# EAGLE design JL_2019_V1.0 (EAGLE 9.3.2)
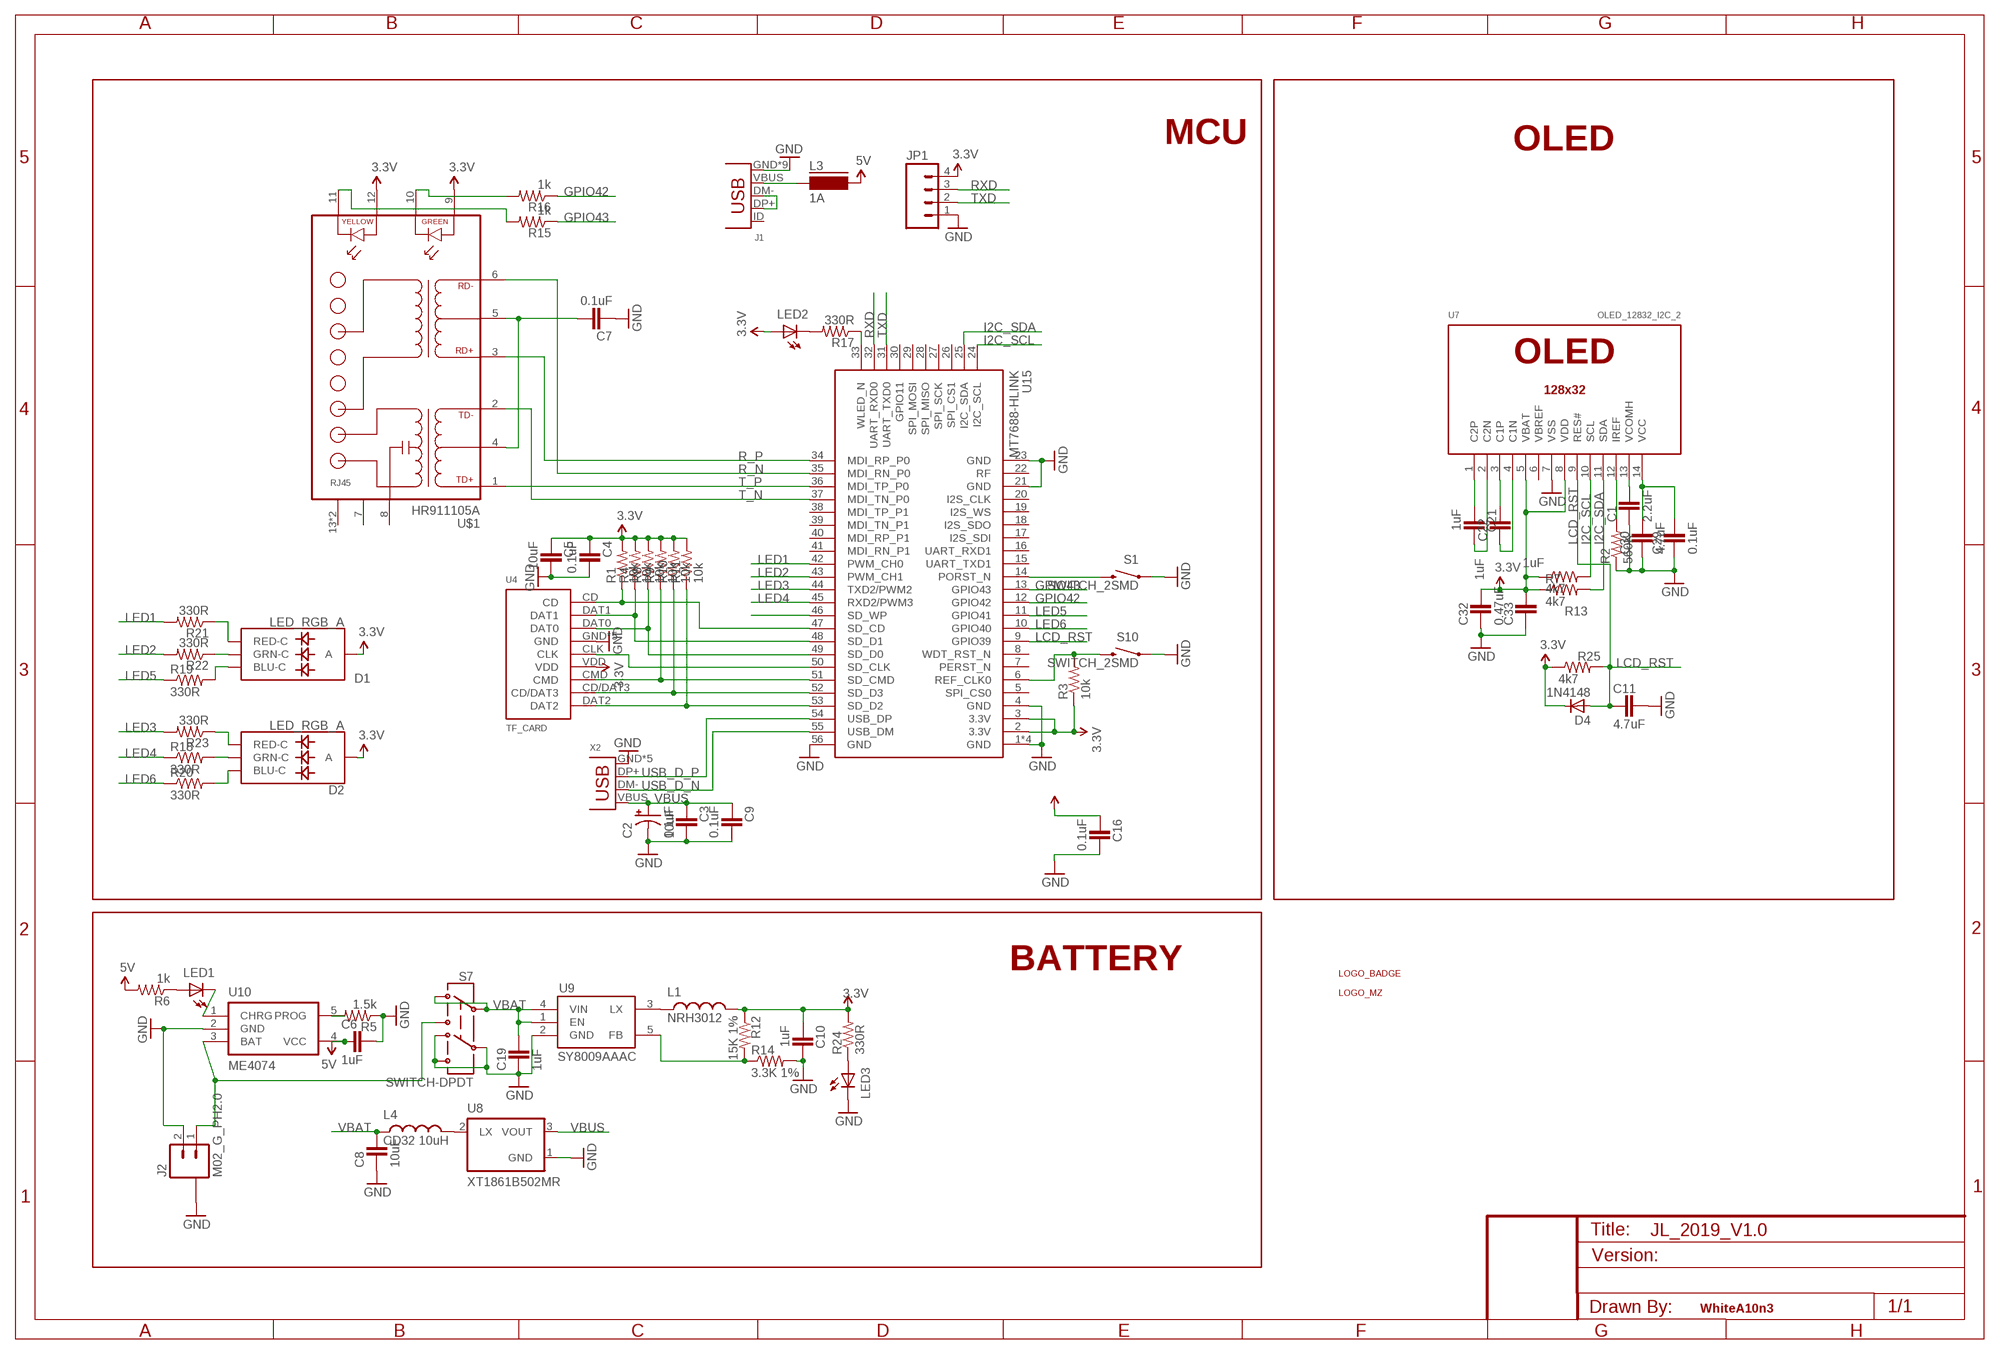
[diagram p0: schematic, sheet 1]

## Parts
C1  2.2uF  CAP0603  [0603-CAP]
C2  10uF  CAP_POL1206  [EIA3216]
C3  0.1uF  CAP0603  [0603-CAP]
C4  0.1uF  CAP0603  [0603-CAP]
C5  10uF  CAP0603  [0603-CAP]
C6  1uF  CAP0603  [0603-CAP]
C7  0.1uF  CAP0603  [0603-CAP]
C8  10uF  CAP0603  [0603-CAP]
C9  0.1uF  CAP0603  [0603-CAP]
C10  1uF  CAP0603  [0603-CAP]
C11  4.7uF  CAP0603  [0603-CAP]
C16  0.1uF  CAP0603  [0603-CAP]
C19  1uF  CAP0603  [0603-CAP]
C21  1uF  CAP0603  [0603-CAP]
C22  1uF  CAP0603  [0603-CAP]
C29  0.1uF  CAP0603  [0603-CAP]
C30  4.7uF  CAP0603  [0603-CAP]
C32  0.47uF  CAP0603  [0603-CAP]
C33  1uF  CAP0603  [0603-CAP]
D1  LED_RGB_A  [RGB-1615-A]
D2  LED_RGB_A  [RGB-1615-A]
D4  1N4148  DIODE_SOD-323F  [SOD-323F]
J1  USB_5_MICRO_4  [USB-MICRO-4]
J2  M02_G_PH2.0  [PH2.0_SMD_2]
JP1  M04PTH  [1X04]
L1  NRH3012  INDUCTOR1210  [1210]
L3  1A  FERRITE-0805  [FB805]
L4  CD32 10uH  INDUCTOR_CD32  [CD32]
LED1  LED0603  [LED-0603]
LED2  LED0603  [LED-0603]
LED3  LED0603  [LED-0603]
R1  10k  RESISTOR0603-RES  [0603-RES]
R2  560K  RESISTOR0603-RES  [0603-RES]
R3  10k  RESISTOR0603-RES  [0603-RES]
R4  10k  RESISTOR0603-RES  [0603-RES]
R5  1.5k  RESISTOR0603-RES  [0603-RES]
R6  1k  RESISTOR0603-RES  [0603-RES]
R7  4k7  RESISTOR0603-RES  [0603-RES]
R8  10k  RESISTOR0603-RES  [0603-RES]
R9  10k  RESISTOR0603-RES  [0603-RES]
R10  10k  RESISTOR0603-RES  [0603-RES]
R11  10k  RESISTOR0603-RES  [0603-RES]
R12  15K 1%  RESISTOR0603-RES  [0603-RES]
R13  4k7  RESISTOR0603-RES  [0603-RES]
R14  3.3K 1%  RESISTOR0603-RES  [0603-RES]
R15  1k  RESISTOR0603-RES  [0603-RES]
R16  1k  RESISTOR0603-RES  [0603-RES]
R17  330R  RESISTOR0603-RES  [0603-RES]
R18  330R  RESISTOR0603-RES  [0603-RES]
R19  330R  RESISTOR0603-RES  [0603-RES]
R20  330R  RESISTOR0603-RES  [0603-RES]
R21  330R  RESISTOR0603-RES  [0603-RES]
R22  330R  RESISTOR0603-RES  [0603-RES]
R23  330R  RESISTOR0603-RES  [0603-RES]
R24  330R  RESISTOR0603-RES  [0603-RES]
R25  4k7  RESISTOR0603-RES  [0603-RES]
S1  SWITCH_2SMD  [TACTILE_SWITCH_SMD]
S7  SWITCH-DPDT  [MSS22D18]
S10  SWITCH_2SMD  [TACTILE_SWITCH_SMD]
U4  TF_CARD  [MICRO-SD-TF]
U5  LOGO_BADGE_24.3_20_S  [LOGO_BADGE_24.3_20_S]
U6  LOGO_MZ_16_14_S  [LOGO_MZ_16_14_S]
U7  OLED_12832_I2C_2  [OLED_12832_0.91_2]
U8  XT1861B502MR  XT1861  [SOT23-3]
U9  SY8009AAAC  SY8009A  [SOT23-5]
U10  ME4074  [SOT23-5]
U15  MT7688-HLINK  [MT7688_HLINK]
U$1  HR911105A  [HR911105A]
X2  USB_4_4  [USB-A-4]

## Nets
3.3V: C4.2 C5.2 C10.2 C16.2 C32.1 C33.1 D1.A D2.A D4.C JP1.4 L1.2 LED2.A R1.2 R3.1 R4.2 R7.1 R8.2 R9.2 R10.2 R11.2 R12.1 R13.1 R24.2 R25.1 U4.VDD U7.5(VBAT) U7.8(VDD) U15.2(3.3V) U15.3(3.3V) U$1.9 U$1.12
5V: C6.2 L3.1 R6.2 U10.4(VCC)
GND: C1.2 C2.C(-) C3.1 C4.1 C5.1 C6.1 C7.2 C8.2 C9.1 C10.1 C11.1 C16.1 C19.2 C29.2 C30.2 C32.2 C33.2 J1.GND J1.MT1(GND) J1.MT2(GND) J1.MT5(GND) J1.MT6(GND) J1.MT7(GND) J1.MT8(GND) J1.MT9(GND) J1.MT10(GND) J2.2 J2.G1(G) J2.G2(G) JP1.1 LED3.C R2.1 R5.1 R14.2 S1.1 S7.4 S7.5 S7.6 S10.1 U4.GND U4.GND1(GND) U4.GND2(GND) U4.GND3(GND) U4.GND4(GND) U7.7(VSS) U8.1(GND) U9.2(GND) U10.2(GND) U15.1(GND) U15.4(GND) U15.21(GND) U15.23(GND) U15.56(GND) U15.PAD1(GND) U15.PAD2(GND) U15.PAD(GND) X2.GND X2.P$5(GND) X2.P$6(GND) X2.P$7(GND) X2.P$8(GND)
GPIO42: R16.1 U15.12(GPIO42)
GPIO43: R15.1 U15.13(GPIO43)
I2C_SCL: R13.2 U7.10(SCL) U15.24(I2C_SCL)
I2C_SDA: R7.2 U7.11(SDA) U15.25(I2C_SDA)
LCD_RST: C11.2 D4.A R25.2 U7.9(RES#) U15.9(GPIO39)
LED1: R21.2 U15.42(PWM_CH0)
LED2: R22.2 U15.43(PWM_CH1)
LED3: R23.2 U15.44(TXD2/PWM2)
LED4: R18.1 U15.45(RXD2/PWM3)
LED5: R19.1 U15.11(GPIO41)
LED6: R20.1 U15.10(GPIO40)
N$1: L4.P$2 U8.2(LX)
N$2: LED3.A R24.1
N$3: J2.1 S7.3 U10.3(BAT)
N$4: C1.1 U7.13(VCOMH)
N$5: D1.R(RED-C) R21.1
N$6: D1.G(GRN-C) R22.1
N$7: R5.2 U10.5(PROG)
N$8: R11.1 U4.DAT2 U15.53(SD_D2)
N$9: R10.1 U4.CD/DAT3 U15.52(SD_D3)
N$10: LED1.A R6.1
N$11: LED1.C U10.1(CHRG)
N$12: J1.VBUS L3.2
N$13: R9.1 U4.CMD U15.51(SD_CMD)
N$14: U4.CLK U15.50(SD_CLK)
N$15: R1.1 U4.CD U15.47(SD_CD)
N$16: C21.2 U7.1(C2P)
N$17: C21.1 U7.2(C2N)
N$18: C22.1 U7.3(C1P)
N$19: C22.2 U7.4(C1N)
N$20: R8.1 U4.DAT0 U15.49(SD_D0)
N$21: C29.1 C30.1 U7.14(VCC)
N$22: R2.2 U7.12(IREF)
N$23: R4.1 U4.DAT1 U15.48(SD_D1)
N$24: L1.1 U9.3(LX)
N$25: R12.2 R14.1 U9.5(FB)
N$26: D1.B(BLU-C) R19.2
N$27: D2.R(RED-C) R23.1
N$28: D2.G(GRN-C) R18.2
N$30: C7.1 U$1.4 U$1.5
N$31: R15.2 U$1.11
N$32: R16.2 U$1.10
N$33: LED2.C R17.2
N$35: R17.1 U15.33(WLED_N)
N$37: U15.46(SD_WP)
N$39: D2.B(BLU-C) R20.2
N$44: J1.DM-(D-) J1.DP+(D+)
R_N: U15.35(MDI_RN_P0) U$1.6
R_P: U15.34(MDI_RP_P0) U$1.3
RST: S1.3 U15.14(PORST_N)
RST2: R3.2 S10.3 U15.6(REF_CLK0)
RXD: JP1.3 U15.32(UART_RXD0)
T_N: U15.37(MDI_TN_P0) U$1.2
T_P: U15.36(MDI_TP_P0) U$1.1
TXD: JP1.2 U15.31(UART_TXD0)
USB_D_N: U15.55(USB_DM) X2.DM-
USB_D_P: U15.54(USB_DP) X2.DP+
VBAT: C8.1 C19.1 L4.P$1 S7.1 S7.2 U9.1(EN) U9.4(VIN)
VBUS: C2.A(+) C3.2 C9.2 U8.3(VOUT) X2.VBUS
Unconnected: J1.ID(USBID) U7.6(VBREF) U15.5(SPI_CS0) U15.7(PERST_N) U15.8(WDT_RST_N) U15.15(UART_TXD1) U15.16(UART_RXD1) U15.17(I2S_SDI) U15.18(I2S_SDO) U15.19(I2S_WS) U15.20(I2S_CLK) U15.22(RF) U15.26(SPI_CS1) U15.27(SPI_SCK) U15.28(SPI_MISO) U15.29(SPI_MOSI) U15.30(GPIO11) U15.38(MDI_TP_P1) U15.39(MDI_TN_P1) U15.40(MDI_RP_P1) U15.41(MDI_RN_P1) U$1.7 U$1.8 U$1.13(G) U$1.14(G)

## Notes on the sheet
- MCU | OLED
- BATTERY
- WhiteA10n3

## Library data of the parts
C1 C3-C11 C16 C19 C21 C22 C29 C30 C32 C33 = 2SparkFun:CAP: Capacitor Standard 0603 ceramic capacitor, and 0.1" leaded capacitor.
C2 = 2SparkFun:CAP_POL: Capacitor Polarized These are standard SMD and PTH capacitors. Normally 10uF, 47uF, and 100uF in electrolytic and tantalum varieties. Always verify the external diameter of the through hole cap, it varies with capacity, voltage, and manufacturer. The EIA devices should be standard.
D1 D2 = 2SparkFun:LED_RGB_A
D4 = 2SparkFun:DIODE: Diode These are standard reverse protection diodes and small signal diodes. SMA package can handle up to about 1A. SOD-323 can handle about 200mA. What the SOD-323 package when ordering, there are some mfgs out there that are 5-pin packages.
J1 = 2SparkFun:USB_5
J2 = 2SparkFun:M02_G
JP1 = 2SparkFun:M04: Header 4 Standard 4-pin 0.1" header. Use with straight break away headers (SKU : PRT-00116), right angle break away headers (PRT-00553), swiss pins (PRT-00743), machine pins (PRT-00117), and female headers (PRT-00115). Molex polarized connector foot print use with SKU : PRT-08231 with associated crimp pins and housings. 1MM SMD Version SKU: PRT-10208
L1 L4 = 2SparkFun:INDUCTOR: Inductors Basic Inductor/Choke - 0603 and 1206. Footprints are not proven and vary greatly between part numbers.
L3 = 2SparkFun:FERRITE: Ferrite bead in various packages
LED1-LED3 = 2SparkFun:LED: LEDs Standard schematic elements and footprints for 5mm, 3mm, 1206, and 0603 sized LEDs. 5mm - Spark Fun Electronics SKU : COM-00529 (and others)
R1-R25 = 2SparkFun:RESISTOR: Resistor Basic schematic elements and footprints for 0603, 1206, and PTH resistors.
S1 S10 = 2SparkFun:SWITCH_2
S7 = 0SparkFun:SWITCH-DPDT: DPDT Version of the COM-00597
U4 = 2SparkFun:TF_CARD
U5 = 2SparkFun:LOGO_BADGE
U6 = 2SparkFun:LOGO_MZ
U7 = 2SparkFun:OLED_12832_I2C
U8 = 2SparkFun:XT1861
U9 = 2SparkFun:SY8009A
U10 = 2SparkFun:ME4074
U15 = 2SparkFun:MT7688-HLINK
U$1 = 2SparkFun:HR911105A
X2 = 2SparkFun:USB_4: USB Connectors USB-B-PTH is fully proven SKU : PRT-00139 USB-miniB is fully proven SKU : PRT-00587 USB-A-PCB is untested. USB-A-H is throughly reviewed, but untested. Spark Fun Electronics SKU : PRT-00437 USB-B-SMT is throughly reviewed, but untested. Needs silkscreen touching up. USB-A-S has not been used/tested USB-MB-H has not been used/tested

## Net classes
0 default: width 0.203 mm, clearance 0.203 mm
1 3.3V: width 0.254 mm

## Board
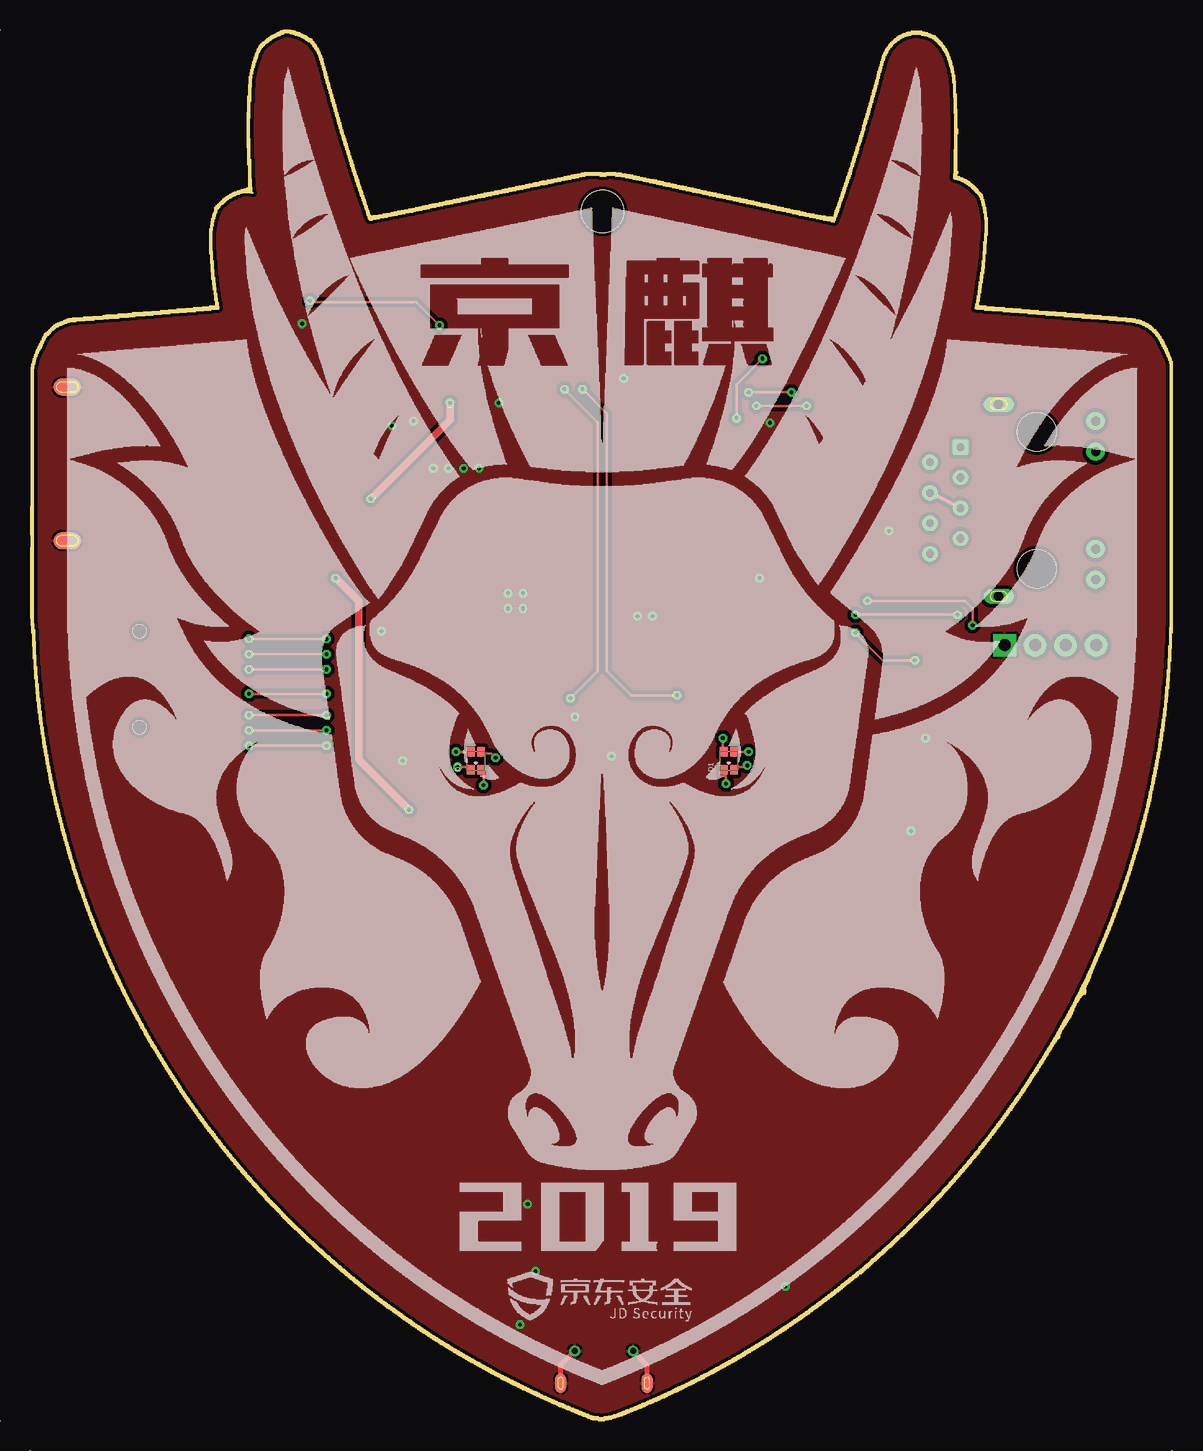
[diagram p1: board, top side]
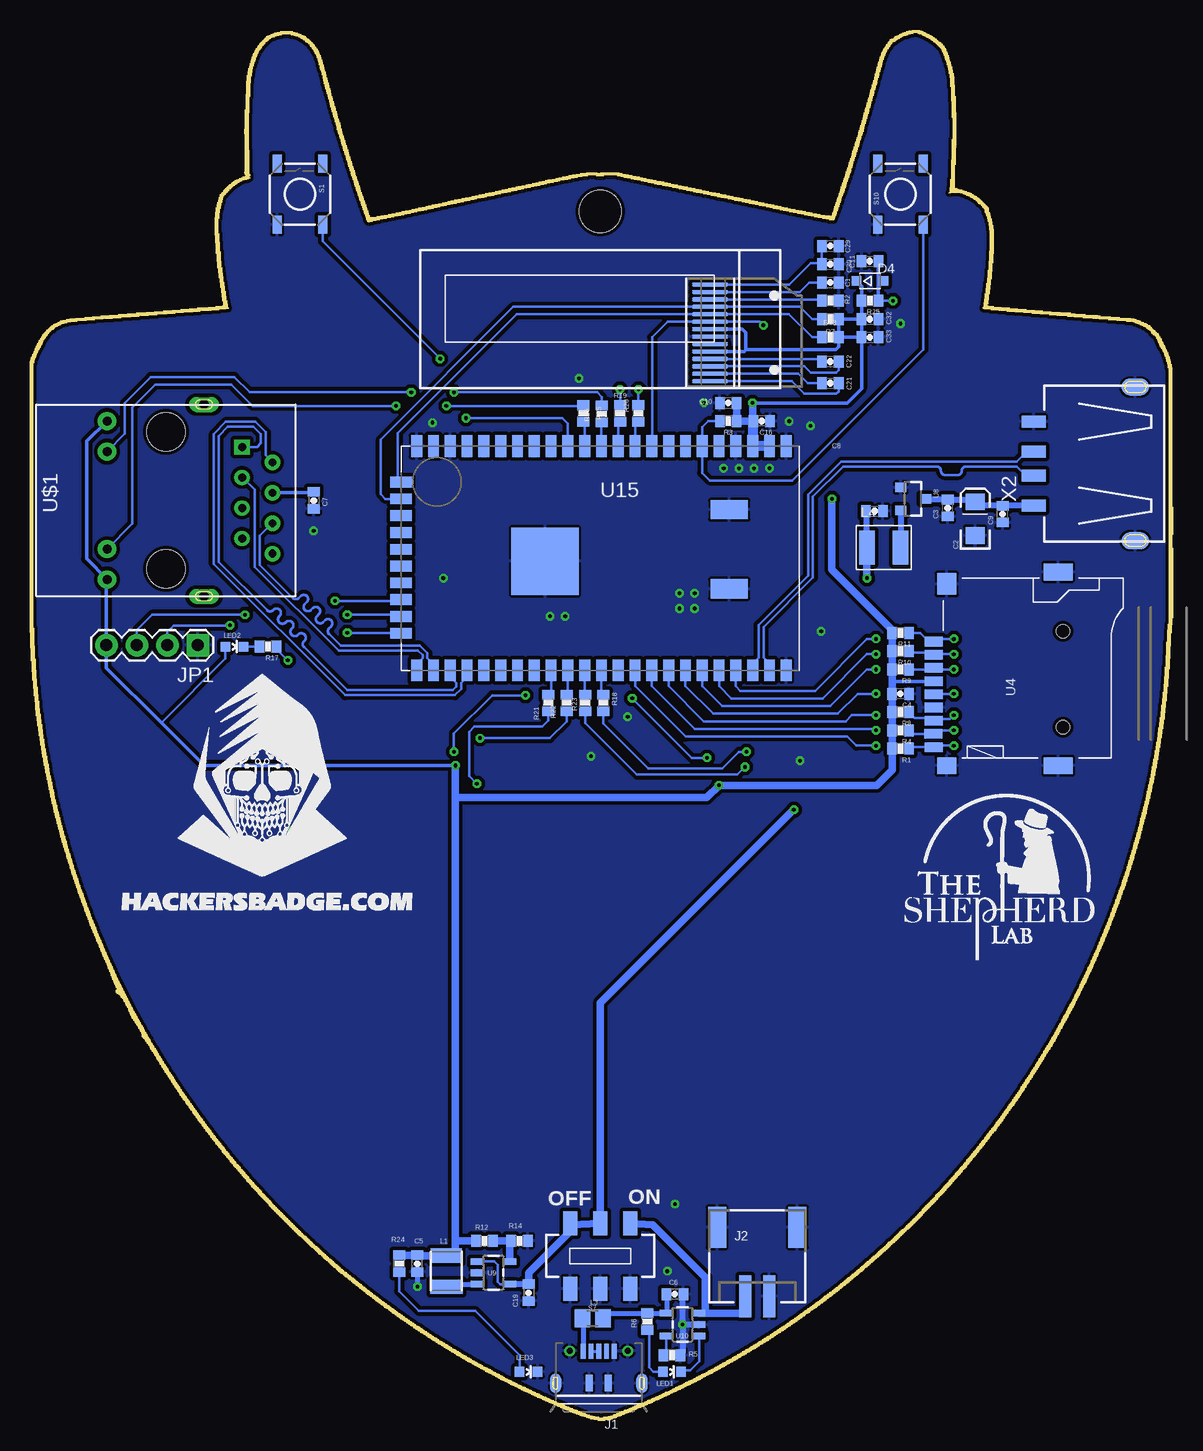
[diagram p2: board, bottom side, seen from below]

Size 95.22 x 115.92 mm. Coordinates in mm from the lower left corner, seen from the top.
Copper layers (1*16): Top 0.035mm / dielectric 1.5mm / Bottom 0.035mm
Design rules "yun": minimum track width 6mil, minimum drill 12mil, track to track 6mil, track to pad 6mil, pad to pad 6mil, via to via 6mil, smd to smd 6mil, copper to edge 10mil, drill to drill 6mil, minimum pad ring 8mil, minimum via ring 8mil, stop-mask expansion 4mil, vias tented up to drill 20mil, thermal gap 8mil
Holes 3.5 mm at 47.7,100.8

### Footprints (pad centres in the part's own frame; a part is rotated, then mirrored left to right if it is on the bottom)
0603-CAP = smd 0.8 x 1: 1 -0.7,0; 2 0.7,0
EIA3216 = smd 1.4 x 1.6: A 1.4,0; C -1.4,0
RGB-1615-A = smd 0.8 x 0.65: A -0.75,-0.425; B 0.75,-0.425; G 0.75,0.425; R -0.75,0.425
SOD-323F = smd 0.8 x 0.8: A 1.125,0; C -1.125,0
USB-MICRO-4 = smd 0.4 x 1.25: DM- 0.65,-1.835; DP+ 0,-1.835; GND -1.3,-1.835; ID -0.65,-1.835; VBUS 1.3,-1.835 | smd 0.6 x 1.35: MT1 0.8,0.815; MT2 -0.8,0.815 | smd 0.9 x 1.6: MT5 3.6,0.815; MT6 -3.6,0.815 | smd 0.9 x 1.6 bottom: MT7 -3.6,0.815; MT8 3.6,0.815 | drill 0.5: MT9 -2.425,-1.86; MT10 2.425,-1.86
PH2.0_SMD_2 = smd 1 x 3.5: 1 -1,-4; 2 1,-4 | smd 1.5 x 3.4: G1 -3.35,1.75; G2 3.35,1.75
1X04 = drill 1 pad 1.88 square: 1 0,0 | drill 1 pad 1.88: 2 2.54,0; 3 5.08,0; 4 7.62,0
1210 = smd 1.2 x 2.7: 1 -1.3,0 | smd 1.2 x 2.6: 2 1.3,0
FB805 = smd 1.3 x 1.5: 1 -0.85,0; 2 0.85,0
CD32 = smd 1.27 x 2.8: P$1 -1.4,0; P$2 1.4,0
LED-0603 = smd 0.8 x 0.8: A 0,-0.75; C 0,0.75
0603-RES = smd 0.8 x 1: 1 -0.7,0; 2 0.7,0
TACTILE_SWITCH_SMD = smd 1.524 x 0.762: 1 -2.54,1.905; 2 2.54,1.905; 3 -2.54,-1.905; 4 2.54,-1.905
MSS22D18 = smd 1.2 x 2: 1 -2.5,2.727; 2 0,2.727; 3 2.5,2.727; 4 -2.5,-2.727; 5 0,-2.727; 6 2.5,-2.727
MICRO-SD-TF = smd 0.8 x 1.5: CD -6.72,4.61; CD/DAT3 0.98,4.61; CLK -2.32,4.61; CMD -0.12,4.61; DAT0 -4.52,4.61; DAT1 -5.62,4.62; DAT2 2.08,4.61; GND -3.42,4.61; VDD -1.22,4.61 | smd 1.4 x 1.6: GND1 -8.27,3.51 | smd 1.8 x 1.6: GND2 6.88,3.51 | smd 1.4 x 2.4: GND3 7.88,-5.79; GND4 -8.27,-5.79 | hole 1.1: 2.93,-6.19; -5.07,-6.19
OLED_12832_0.91_2 = smd 3 x 0.35: 1 9.15,-5.18; 2 9.15,-4.56; 3 9.15,-3.94; 4 9.15,-3.32; 5 9.15,-2.7; 6 9.15,-2.08; 7 9.15,-1.46; 8 9.15,-0.84; 9 9.15,-0.22; 10 9.15,0.4; 11 9.15,1.02; 12 9.15,1.64; 13 9.15,2.26; 14 9.15,2.88
SOT23-3 = smd 0.8 x 0.9: 1 -0.95,-1; 2 0.95,-1; 3 0,1.1
SOT23-5 = smd 1.1 x 0.55: 1 -1.35,0.95; 2 -1.35,0; 3 -1.35,-0.95; 4 1.35,-0.95; 5 1.35,0.95
MT7688_HLINK = smd 0.9 x 1.8: 1 15.5,9.35; 2 14.1,9.35; 3 12.7,9.35; 4 11.3,9.35; 5 9.9,9.35; 6 8.5,9.35; 7 7.1,9.35; 8 5.7,9.35; 9 4.3,9.35; 10 2.9,9.35; 11 1.5,9.35; 12 0.1,9.35; 13 -1.3,9.35; 14 -2.7,9.35; 15 -4.1,9.35; 16 -5.5,9.35; 17 -6.9,9.35; 18 -8.3,9.35; 19 -9.7,9.35; 20 -11.1,9.35; 21 -12.5,9.35; 22 -13.9,9.35; 23 -15.3,9.35; 34 -15.3,-9.35; 35 -13.9,-9.35; 36 -12.5,-9.35; 37 -11.1,-9.35; 38 -9.7,-9.35; 39 -8.3,-9.35; 40 -6.9,-9.35; 41 -5.5,-9.35; 42 -4.1,-9.35; 43 -2.7,-9.35; 44 -1.3,-9.35; 45 0.1,-9.35; 46 1.5,-9.35; 47 2.9,-9.35; 48 4.3,-9.35; 49 5.7,-9.35; 50 7.1,-9.35; 51 8.5,-9.35; 52 9.9,-9.35; 53 11.3,-9.35; 54 12.7,-9.35; 55 14.1,-9.35; 56 15.5,-9.35 | smd 1.8 x 0.9: 24 -16.6,6.35; 25 -16.6,4.95; 26 -16.6,3.55; 27 -16.6,2.15; 28 -16.6,0.75; 29 -16.6,-0.65; 30 -16.6,-2.05; 31 -16.6,-3.45; 32 -16.6,-4.85; 33 -16.6,-6.25 | smd 5.6 x 5.6: PAD -4.6,-0.25 | smd 3.1 x 1.6: PAD1 10.75,4.05; PAD2 10.75,-2.55
HR911105A = drill 0.65 pad 1.27 square: 1 4.445,-17.145 | drill 0.65 pad 1.27: 2 3.175,-19.685; 3 1.905,-17.145; 4 0.635,-19.685; 5 -0.635,-17.145; 6 -1.905,-19.685; 7 -3.175,-17.145; 8 -4.445,-19.685 | drill 0.75 pad 1.524: 9 6.604,-5.893; 10 4.064,-5.893; 11 -4.064,-5.893; 12 -6.604,-5.893 | drill 0.8 pad 1.27 long: 13 8.001,-13.97; 14 -8.001,-13.97 | hole 3.2: 5.715,-10.795; -5.715,-10.795
USB-A-4 = smd 1 x 2: DM- -1,4.9; DP+ 1,4.9; GND 3.5,4.9; VBUS -3.5,4.9 | smd 1.4 x 2.3 bottom: P$5 -6.4,-3.57; P$6 6.4,-3.57 | smd 1.4 x 2.3: P$7 -6.4,-3.57; P$8 6.4,-3.57

### Placement (x,y rotation side)
C1  28.52,94.87 0 bottom
C2  16.46,75.18 90 bottom
C3  18.74,76.07 90 bottom
C4  22.68,60.58 180 bottom
C5  62.94,13.08 90 bottom
C6  41.48,10.54 180 bottom
C7  71.58,76.71 270 bottom
C8  24.84,75.82 0 bottom
C9  14.17,75.56 90 bottom
C10  37.03,84.84 0 bottom
C11  25.22,96.65 0 bottom
C16  34.24,83.31 180 bottom
C19  53.67,10.67 270 bottom
C21  28.52,86.49 0 bottom
C22  28.52,88.27 180 bottom
C29  28.52,97.92 0 bottom
C30  28.52,96.39 0 bottom
C32  25.22,91.82 0 bottom
C33  25.22,90.3 0 bottom
D1  58.24,54.99 90 top
D2  37.16,54.99 90 top
D4  25.22,95 0 bottom
J1  47.83,3.94 180 bottom
J2  34.62,14.35 0 bottom
JP1  81.23,64.64 180 bottom
L1  60.53,12.45 90 bottom
L3  48.34,8.51 180 bottom
L4  24.08,72.77 0 bottom
LED1  41.73,4.06 270 bottom
LED2  78.18,64.52 270 bottom
LED3  53.67,4.06 270 bottom
R1  22.68,56.01 180 bottom
R2  28.52,93.34 180 bottom
R3  37.03,83.31 180 bottom
R4  22.68,57.53 180 bottom
R5  41.73,5.46 180 bottom
R6  43.76,8.26 90 bottom
R7  28.52,91.82 180 bottom
R8  22.68,59.05 180 bottom
R9  22.68,62.61 180 bottom
R10  22.68,64.14 180 bottom
R11  22.68,65.66 180 bottom
R12  57.35,14.99 0 bottom
R13  28.52,90.3 180 bottom
R14  54.43,14.99 0 bottom
R15  49.1,83.95 90 bottom
R16  47.56,83.93 90 bottom
R17  75.39,64.52 180 bottom
R18  47.45,59.82 270 bottom
R19  46.05,83.95 90 bottom
R20  44.53,83.95 90 bottom
R21  52.02,59.82 90 bottom
R22  50.49,59.82 90 bottom
R23  48.97,59.82 90 bottom
R24  64.46,13.08 90 bottom
R25  25.22,93.34 0 bottom
S1  72.72,102.23 90 bottom
S7  47.7,13.72 0 bottom
S10  22.68,102.23 90 bottom
U4  15.32,62.87 90 bottom
U5  87.58,42.55 0 bottom
U6  22.33,38.38 0 bottom
U7  47.7,91.82 0 bottom
U8  21.67,76.83 270 bottom
U9  56.59,12.32 0 bottom
U10  40.84,8 180 bottom
U15  47.7,71.88 0 bottom
U$1  94.69,76.71 90 bottom
X2  6.68,79.76 90 bottom

### Tracks (layer width: path | path; a pad name or v marks a point on that pad's centre or on a via)
3.3V  (via drill 0.3)
  Top 0.203: D1.A 58.91,54.48 59.64,54.48 v59.77,54.61 | D2.A 37.79,54.03 v37.79,52.96
  Top 0.61: v28.4,76.83 35,83.44 v35,84.84
  Bottom 0.203: LED2.A 78.93,63.51 84.21,58.23 84.34,58.23
  Bottom 0.305: R13.1 R7.1 C32.1 | C32.1 C33.1 | C33.1 R13.1 | C32.1 R25.1 25.92,94.57 D4.C | U7.5 35.72,89.12 35.56,89.28 | R13.1 27.82,89.53 28.07,89.28 35.56,89.28 | U7.8 35.86,90.98 35.56,90.68 35.56,89.28 | U$1.9 90.5,81.63 90.5,71.85 U$1.12 88.85,70.08 JP1.4 88.85,62.74 84.34,58.23 80.72,54.61 v59.77,54.61 | U4.VDD 19.98,61.59 23.38,61.59 | R9.2 23.38,61.59 | 23.38,61.59 C4.2 | C33.1 25.92,86.04 27.13,84.84 v35,84.84
  Bottom 0.508: v59.77,54.61 59.77,51.94 59.77,14.99 | L1.2 60.02,13.75 59.77,14
  Bottom 0.61: v59.77,54.61 59.77,14.99 | 59.77,14.99 59.77,14 | R12.1 59.77,14.99 | L1.2 62.91,13.75 C5.2 R24.2 | 59.77,51.94 38.81,51.94 v37.79,52.96 24.65,52.96 23.38,54.23 R1.2 R4.2 R8.2 C4.2 R9.2 R10.2 R11.2 23.38,65.91 28.4,70.93 v28.4,76.83 | v35,84.84 35,83.37 C16.2 R3.1 C10.2
  Bottom 0.813: U15.2 U15.3 35,83.25 C16.2
5V
  Bottom 0.305: R6.2
  Bottom 0.406: R6.2 U10.4 42.18,8.97 C6.2 | R6.2 47.04,8.96 L3.1
GND  (via drill 0.3)
  Top 0.406: J1.MT7 44.23,4.62 J1.MT9 | J1.MT5 51.43,4.62 J1.MT10
  Bottom 0.406: C5.1 v62.94,11.18
  Bottom 0.508: U10.2 v40.84,8 | v40.84,8 40.84,5.65 R5.1 | v40.84,8 40.84,10.48 C6.1
  other vias: 60.78,70.23 29.29,65.79 73.41,49.15 41.1,68.96 41.48,18.03 42.11,12.45 22.68,91.44 31.95,83.31 74.62,56.9 36.14,79.38 39.06,84.84 30.17,82.93 50.62,67.06 51.89,67.06 39.83,68.96 39.83,67.69 41.1,67.69 34.87,79.38 33.6,79.38 37.41,79.38 61.67,83.19 71.58,74.17 48.46,55.37 31.06,54.99 45.41,58.67 49.48,86.87
  pour Bottom (isolate 0.305, rank 2): -0.3,0 95.7,0 95.7,116 -0.3,116
  pour Top (isolate 0.305, rank 2): -0.3,0 95.7,0 95.7,116 -0.3,116
GPIO42
  Bottom 0.203: U15.12 47.6,83.19 R16.1
GPIO43
  Bottom 0.203: U15.13 49,83.15 R15.1
I2C_SCL
  Bottom 0.203: R13.2 30.05,90.3 31.97,92.22 U7.10 54.67,92.22 64.55,82.33 64.55,78.49 U15.24
I2C_SDA
  Bottom 0.203: R7.2 30.05,91.82 31.07,92.84 U7.11 54.94,92.84 65.99,81.79 65.99,77.22 65.6,76.83 U15.25
LCD_RST  (via drill 0.3)
  Top 0.203: v34.11,91.31 32.21,93.22 23.44,93.22 v23.32,93.34
  Bottom 0.203: U15.9 43.37,81.24 43.37,90.31 42.08,91.6 U7.9 34.4,91.6 v34.11,91.31 | R25.2 v23.32,93.34
  Bottom 0.305: C11.2 24.52,95 | 24.52,95 R25.2 | D4.A 24.52,95
LED1
  Bottom 0.203: U15.42 51.8,60.73 R21.2
LED2
  Bottom 0.203: U15.43 50.4,60.61 R22.2
LED3
  Bottom 0.203: U15.44 49,60.55 R23.2
LED4
  Bottom 0.203: U15.45 47.6,60.67 R18.1
LED5
  Bottom 0.203: U15.11 46.2,83.1 R19.1
LED6
  Bottom 0.203: U15.10 44.8,82.97 R20.1
N$1
  Bottom 0.508: U8.2 22.67,72.78 L4.P$2
N$2
  Bottom 0.203: R24.1 64.46,10.79 62.81,9.14 58.11,9.14 54.42,5.45 LED3.A
N$3
  Bottom 0.508: 35.62,8.91 J2.1
  Bottom 0.61: 35.62,8.91 35.66,8.95 38.94,8.95 | U10.3 38.94,8.95 | S7.3 43.32,16.32 38.94,11.94 38.94,8.95
N$4
  Bottom 0.203: U7.13 31.09,94.08 30.3,94.87 C1.1
N$5  (via drill 0.3)
  Top 0.203: D1.R 57.99,54.07 v57.99,53.09
  Bottom 0.203: v57.99,53.09 58.62,53.72 58.62,57.4 58.18,57.85 52.53,57.85 52.02,58.35 R21.1
N$6  (via drill 0.3)
  Top 0.203: D1.G 57.73,55.82 v57.73,56.9
  Bottom 0.203: v57.73,56.9 51.89,56.9 50.49,58.29 R22.1
N$7
  Bottom 0.203: U10.5 42.19,5.7 R5.2
N$8  (via drill 0.3)
  Top 0.203: v24.71,65.15 v18.24,65.15
  Bottom 0.203: R11.1 21.02,65.66 20.31,64.94 U4.DAT2 19.72,65.15 v18.24,65.15 | U15.53 36.4,61.22 36.02,60.83 29.79,60.83 25.48,65.15 v24.71,65.15
N$9  (via drill 0.3)
  Top 0.203: v24.71,63.88 v18.24,63.88
  Bottom 0.203: R10.1 21.85,64.01 20.09,64.01 U4.CD/DAT3 19.89,63.88 v18.24,63.88 | U15.52 37.8,61.22 36.78,60.2 29.16,60.2 25.48,63.88 v24.71,63.88
N$10
  Bottom 0.203: R6.1 43.64,7.43 43.64,4.43 43.27,4.06 LED1.A
N$11
  Bottom 0.203: LED1.C 40.85,4.19 40.18,4.19 39.45,4.93 39.45,7.05 U10.1
N$12
  Bottom 0.406: J1.VBUS 49.13,8.3 L3.2
N$13  (via drill 0.3)
  Top 0.203: v24.71,62.61 v18.24,62.61
  Bottom 0.203: R9.1 20.06,62.61 U4.CMD 19.79,62.61 v18.24,62.61 | v24.71,62.61 25.48,62.61 28.52,59.56 37.54,59.56 39.2,61.22 U15.51
N$14  (via drill 0.3)
  Top 0.203: v24.71,60.58 v18.24,60.58
  Bottom 0.203: v24.71,60.58 26.24,60.58 27.89,58.93 38.3,58.93 40.6,61.23 U15.50 | v18.24,60.58 19.89,60.58 U4.CLK
N$15  (via drill 0.3)
  Top 0.203: v18.24,56.26 v24.71,56.26
  Bottom 0.203: R1.1 21.84,56.15 U4.CD 19.81,56.26 v18.24,56.26 | U15.47 44.8,61.23 40.59,57.02 27.13,57.02 26.36,56.26 v24.71,56.26
N$16
  Bottom 0.203: C21.2 27.82,85.79 28.02,85.6 30.68,85.6 31.73,86.64 U7.1
N$17
  Bottom 0.203: U7.2 31.2,87.26 30.43,86.49 C21.1
N$18
  Bottom 0.203: C22.1 27.82,87.57 28.02,87.38 30.17,87.38 30.68,87.88 U7.3
N$19
  Bottom 0.203: C22.2 29.24,88.25 29.5,88.5 U7.4
N$20  (via drill 0.3)
  Top 0.203: v24.71,58.8 v18.24,58.8
  Bottom 0.203: R8.1 21.47,58.55 20.13,58.55 U4.DAT0 19.8,58.47 18.57,58.47 v18.24,58.8 | U15.49 42,61.23 39.06,58.29 27.25,58.29 26.75,58.8 v24.71,58.8
N$21
  Bottom 0.203: C29.1 C30.1 29.31,96.48 30.17,96.48 31.95,94.7 U7.14
N$22
  Bottom 0.203: U7.12 29.34,93.46 R2.2
N$23  (via drill 0.3)
  Top 0.203: v18.24,57.53 v24.71,57.53
  Bottom 0.203: R4.1 21.7,57.24 U4.DAT1 19.65,57.53 v18.24,57.53 | U15.48 43.4,61.23 39.83,57.66 24.84,57.66 v24.71,57.53
N$24
  Bottom 0.406: U9.3 60.3,11.37 L1.1
N$25
  Bottom 0.61: R12.2 R14.1 55.24,14.88 U9.5
N$26  (via drill 0.3)
  Top 0.203: D1.B 58.68,55.75 v59.89,55.75 | v46.05,85.98 48.08,83.95 48.08,62.48 50.11,60.45 v53.92,60.45
  Bottom 0.203: R19.2 v46.05,85.98 | v53.92,60.45 56.72,60.45 59.89,57.28 v59.89,55.75
N$27  (via drill 0.3)
  Top 0.203: D2.R 36.49,54.48 v35.64,54.48
  Bottom 0.203: v35.64,54.48 36.27,53.85 44.65,53.85 48.97,58.17 R23.1
N$28  (via drill 0.3)
  Top 0.203: D2.G 36.72,55.75 v35.51,55.75
  Bottom 0.203: R18.2 47.45,58.1 43.7,54.36 37.54,54.36 36.14,55.75 v35.51,55.75
N$30
  Top 0.305: U$1.4 U$1.5
  Bottom 0.305: U$1.4 71.61,77.38 C7.1
N$31  (via drill 0.3)
  Top 0.203: v60.53,84.58 v64.72,84.58
  Bottom 0.203: R15.2 49.16,84.58 v60.53,84.58 | v64.72,84.58 76.66,84.58 78.43,86.36 84.78,86.36 86.69,84.45 86.69,74.77 U$1.11
N$32  (via drill 0.3)
  Top 0.203: v59.89,85.72 v63.45,85.72
  Bottom 0.203: R16.2 47.56,85.33 47.95,85.72 v59.89,85.72 | v63.45,85.72 76.91,85.72 78.18,87 85.17,87 87.32,84.84 87.32,82.27 U$1.10
N$33
  Bottom 0.203: R17.2 LED2.C
N$35  (via drill 0.3)
  Top 0.203: v73.73,63.37 71.07,63.37 v68.78,65.66
  Bottom 0.203: U15.33 64.33,65.66 v68.78,65.66 | R17.1 74.69,64.32 v73.73,63.37
N$39  (via drill 0.3)
  Top 0.203: D2.B 37.7,55.63 38.43,55.63 v38.81,55.24 | v44.53,85.98 47.32,83.19 47.32,62.48 v45.03,60.2
  Bottom 0.203: R20.2 v44.53,85.98 | v45.03,60.2 40.08,55.24 v38.81,55.24
N$44
  Bottom 0.254: J1.DM- J1.DP+
R_N
  Bottom 0.203: U15.35 61.6,63.07 62.1,63.58 62.1,63.97 62.73,64.59 69.33,64.59 70.29,65.55 arc90 70.29,66.05 70.13,66.21 arc-90 70.13,66.71 70.13,66.72 arc-90 70.64,66.72 70.79,66.56 arc90 71.3,66.56 71.3,66.56 arc90 71.3,67.06 71.14,67.22 arc-90 71.14,67.72 71.14,67.72 arc-90 71.65,67.72 71.8,67.57 arc90 72.31,67.57 72.31,67.57 arc90 72.31,68.07 72.15,68.23 arc-90 72.15,68.73 72.15,68.73 arc-90 72.66,68.73 72.81,68.58 arc90 73.32,68.58 76.07,71.33 76.07,73.79 75.02,74.83 U$1.6
R_P
  Bottom 0.203: U15.34 63,63.08 62.51,63.58 62.51,63.8 62.9,64.19 69.5,64.19 76.48,71.16 76.48,77.59 U$1.3
RST  (via drill 0.3)
  Top 0.203: v61.04,88.52 58.88,86.36 v58.88,83.57
  Bottom 0.203: S1.3 70.81,98.3 v61.04,88.52 | v58.88,83.57 50.88,83.57 50.4,83.09 U15.14
RST2
  Bottom 0.203: R3.2 38.68,83.31 39.19,82.81 39.19,81.14 U15.6 39.2,79 38.56,78.36 31.7,78.36 20.78,89.28 S10.3
RXD  (via drill 0.3)
  Top 0.203: v77.29,67.18 v68.78,67.18
  Bottom 0.203: U15.32 64.45,67.18 v68.78,67.18 | JP1.3 86.31,65.91 85.04,67.18 v77.29,67.18
T_N
  Bottom 0.203: U15.37 58.8,61.95 59.28,61.47 59.28,61 59.81,60.48 68.97,60.48 79.91,71.42 79.91,82.25 78.9,83.26 76.45,83.26 75.56,82.38 75.56,80.48 U$1.2
T_P
  Bottom 0.203: U15.36 60.2,61.98 59.69,61.47 59.69,61.17 59.98,60.88 68.8,60.88 72.39,64.47 arc90 72.39,64.97 72.34,65.01 arc-90 72.34,65.52 72.36,65.53 arc-90 72.86,65.53 72.9,65.49 arc90 73.4,65.49 73.42,65.5 arc90 73.42,66 73.38,66.05 arc-90 73.38,66.55 73.39,66.56 arc-90 73.89,66.56 73.93,66.52 arc90 74.44,66.52 74.45,66.53 arc90 74.45,67.04 74.41,67.08 arc-90 74.41,67.58 74.42,67.6 arc-90 74.93,67.6 74.97,67.55 arc90 75.47,67.55 79.5,71.58 79.5,82.08 78.73,82.86 76.61,82.86 75.97,82.21 75.97,81.49 76.29,81.17 77.52,81.17 U$1.1
TXD  (via drill 0.3)
  Top 0.203: v69.8,68.33 77.93,68.33 78.56,67.69 v78.56,66.29
  Bottom 0.203: U15.31 64.41,68.33 v69.8,68.33 | v78.56,66.29 83.26,66.29 83.77,65.79 JP1.2
USB_D_N
  Bottom 0.203: X2.DM- 12.23,78.76 13,79.53 17.22,79.53 arc-90 17.58,79.17 arc90 17.93,78.82 18.95,78.82 arc90 19.31,79.17 arc-90 19.66,79.53 27.45,79.53 29.97,77 29.97,70.27 34.09,66.16 34.09,63.6 33.6,63.12 U15.55
USB_D_P
  Bottom 0.203: X2.DP+ 12.18,80.76 13,79.93 27.62,79.93 30.38,77.17 30.38,70.44 34.49,66.33 34.49,63.6 35,63.09 U15.54
VBAT  (via drill 0.3)
  Top 0.61: v25.48,70.23 27.38,68.33 27.38,55.12 v31.57,50.93
  Bottom 0.203: U9.1 56.54,13.27 56.24,12.97 56.24,11.57 56.04,11.37 U9.4
  Bottom 0.508: C8.1 25.54,72.83 L4.P$1 | 50.2,15.79 50.2,16.26 | 50.2,16.26 S7.1 | C19.1 U9.4 | 50.14,16.32 50.2,16.26
  Bottom 0.61: 50.14,16.32 S7.2 47.7,34.8 v31.57,50.93 | S7.1 50.2,15.79 53.67,12.32 C19.1 | L4.P$1 v25.48,70.23
VBUS
  Bottom 0.508: X2.VBUS C9.2 16.14,76.27 C2.A 16.65,76.77 C3.2 20.5,76.77 U8.3

### Text on the board
bPlace: ON | OFF